# EAGLE design adc (EAGLE 6.6.0)
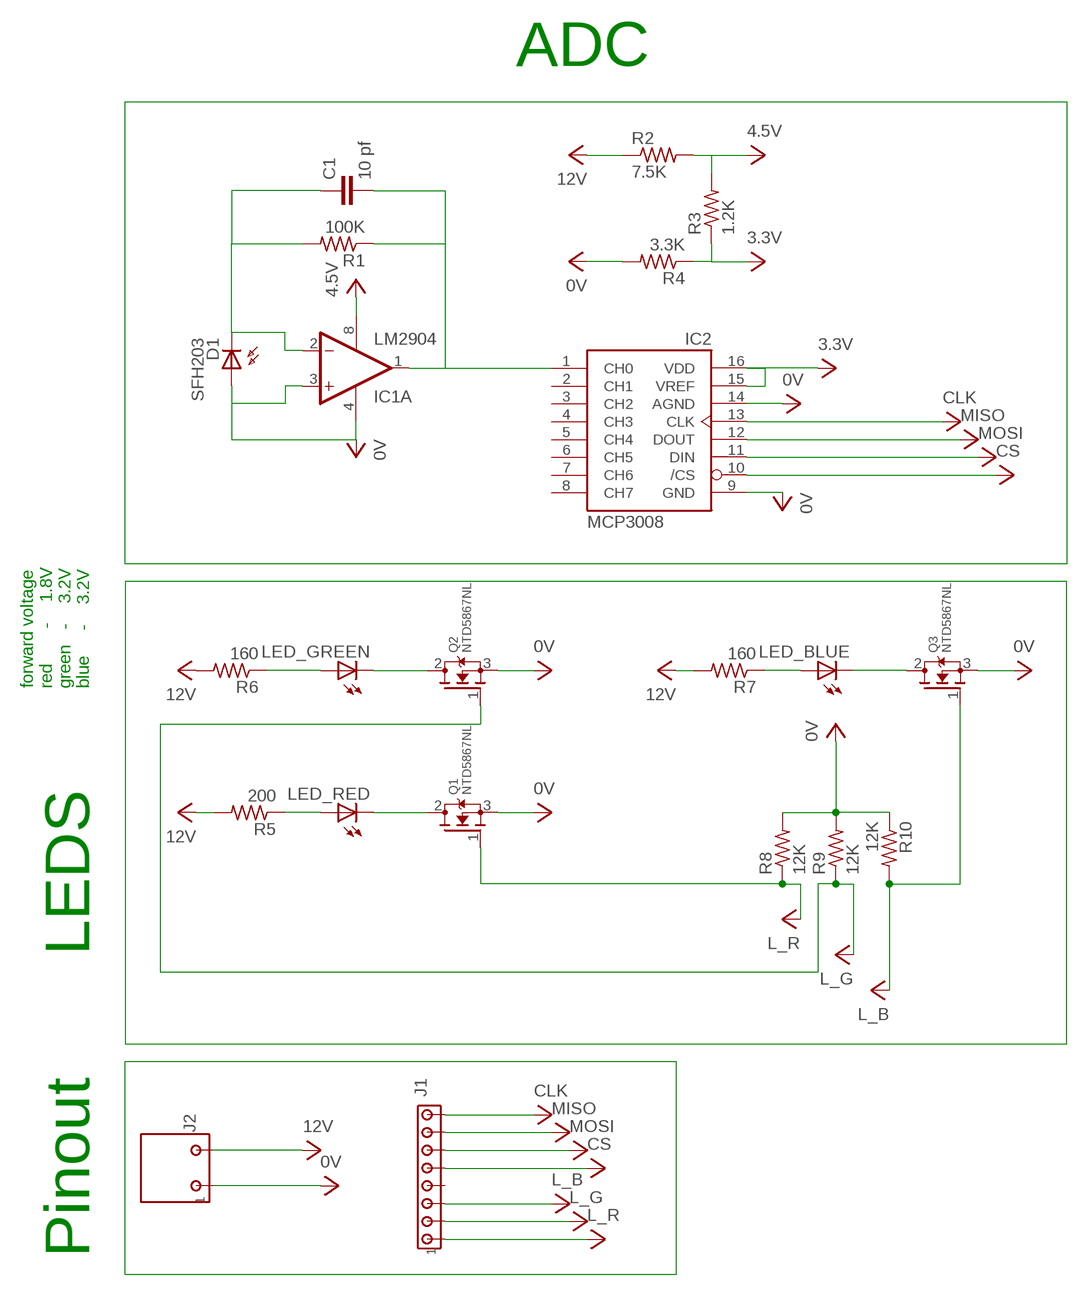
[diagram p0: schematic, sheet 1]

## Parts
C1  10 pf  C5/2.5  [C5B2.5]
D1  SFH203  SFH205  [SFH205]
IC1  LM2904  LM358N  [DIL08]
IC2  MCP3008  [DIL16]
J1  MTA08-100  [10X08MTA]
J2  MTA03-100  [10X03MTA]
LED_BLUE  LED5MM  [LED5MM]
LED_GREEN  LED5MM  [LED5MM]
LED_RED  LED5MM  [LED5MM]
Q1  NTD5867NL  MOSFET-NGDS_TO220V  [TO220V]
Q2  NTD5867NL  MOSFET-NGDS_TO220V  [TO220V]
Q3  NTD5867NL  MOSFET-NGDS_TO220V  [TO220V]
R1  100K  R-US_0207/10  [0207/10]
R2  7.5K  R-US_0207/10  [0207/10]
R3  1.2K  R-US_0207/10  [0207/10]
R4  3.3K  R-US_0207/10  [0207/10]
R5  200  R-US_0207/10  [0207/10]
R6  160  R-US_0207/10  [0207/10]
R7  160  R-US_0207/10  [0207/10]
R8  12K  R-US_0207/10  [0207/10]
R9  12K  R-US_0207/10  [0207/10]
R10  12K  R-US_0207/10  [0207/10]

## Nets
0V: D1.A IC1.3(A:+IN) IC1.4(P:V-) IC2.9(GND) IC2.14(AGND) J2.1 Q1.3(S) Q2.3(S) Q3.3(S) R4.2 R8.2 R9.2 R10.1
3.3V: IC2.15(VREF) IC2.16(VDD) R3.1 R4.1
4.5V: IC1.8(P:V+) R2.2 R3.2
12V: J2.3 R2.1 R5.2 R6.2 R7.2
CLK: IC2.13(CLK) J1.8
CS: IC2.10(/CS) J1.5
L_B: J1.3 Q3.1(G) R10.2
L_G: J1.2 Q2.1(G) R9.1
L_R: J1.1 Q1.1(G) R8.1
MISO: IC2.12(DOUT) J1.7
MOSI: IC2.11(DIN) J1.6
N$1: C1.1 D1.K(C) IC1.2(A:-IN) R1.2
N$2: LED_BLUE.K(C) Q3.2(D)
N$3: LED_RED.A R5.1
N$6: LED_RED.K(C) Q1.2(D)
N$7: C1.2 IC1.1(A:OUT) IC2.1(CH0) R1.1
N$8: LED_BLUE.A R7.1
N$12: LED_GREEN.A R6.1
N$13: LED_GREEN.K(C) Q2.2(D)
Unconnected: IC1.5(B:+IN) IC1.6(B:-IN) IC1.7(B:OUT) IC2.2(CH1) IC2.3(CH2) IC2.4(CH3) IC2.5(CH4) IC2.6(CH5) IC2.7(CH6) IC2.8(CH7) J1.4

## Notes on the sheet
- ADC
- forward voltage
  red       -    1.8V
  green   -    3.2V
  blue     -    3.2V
- LEDS
- Pinout

## Library data of the parts
C1 = capacitor-wima:C: CAPACITOR naming: grid - package width
D1 = opto-trans-siemens:SFH205: PHOTO DIODE; OC_FARNELL: unknown; OC_NEWARK: unknown
IC1 = linear:LM358: OP AMP also LM158; LM258; LM2904 Source: http://cache.national.com/ds/LM/LM158.pdf
IC2 = adafruit:MCP3008
J1 = con-amp:MTA08-100: AMP connector
J2 = my_lbr:MTA03-100: AMP connector
LED_BLUE LED_GREEN LED_RED = adafruit:LED: LED OSRAM: - CHIPLED LG R971, LG N971, LY N971, LG Q971, LY Q971, LO R971, LY R971 LH N974, LH R974 LS Q976, LO Q976, LY Q976 LO Q996 - Hyper CHIPLED LW Q18S LB Q993, LB Q99A, LB R99A - SideLED LS A670, LO A670, LY A670, LG A670, LP A670 LB A673, LV A673, LT A673, LW A673 LH A674 LY A675 LS A676, LA A676, LO A676, LY A676, LW A676 LS A679, LY A679, LG A679 - Hyper Micro SIDELED® LS Y876, LA Y876, LO Y876, LY Y876 LT Y87S - SmartLED LW L88C, LW L88S LB L89C, LB L89S, LG L890 LS L89K, LO L89K, LY L89K LS L896, LA L896, LO L896, LY L896 - TOPLED LS T670, LO T670, LY T670, LG T670, LP T670 LSG T670, LSP T670, LSY T670, LOP T670, LYG T670 LG T671, LOG T671, LSG T671 LB T673, LV T673, LT T673, LW T673 LH T674 LS T676, LA T676, LO T676, LY T676, LB T676, LH T676, LSB T676, LW T676 LB T67C, LV T67C, LT T67C, LS T67K, LO T67K, LY T67K, LW E67C LS E67B, LA E67B, LO E67B, LY E67B, LB E67C, LV E67C, LT E67C LW T67C LS T679, LY T679, LG T679 LS T770, LO T770, LY T770, LG T770, LP T770 LB T773, LV T773, LT T773, LW T773 LH T774 LS E675, LA E675, LY E675, LS T675 LS T776, LA T776, LO T776, LY T776, LB T776 LHGB T686 LT T68C, LB T68C - Hyper Mini TOPLED® LB M676 - Mini TOPLED Santana® LG M470 LS M47K, LO M47K, LY M47K Source: http://www.osram.convergy.de/
Q1-Q3 = adafruit:MOSFET-N: N-Channel Mosfet 2N7002E - 60V 260mA SOT23 [Digikey: 2N7002ET1GOSTR-ND] - REEL BSH103 - 30V 850mA SOT23 [Digikey: 568-5013-1-ND]
R1-R10 = rcl:R-US_: RESISTOR, American symbol

## Board
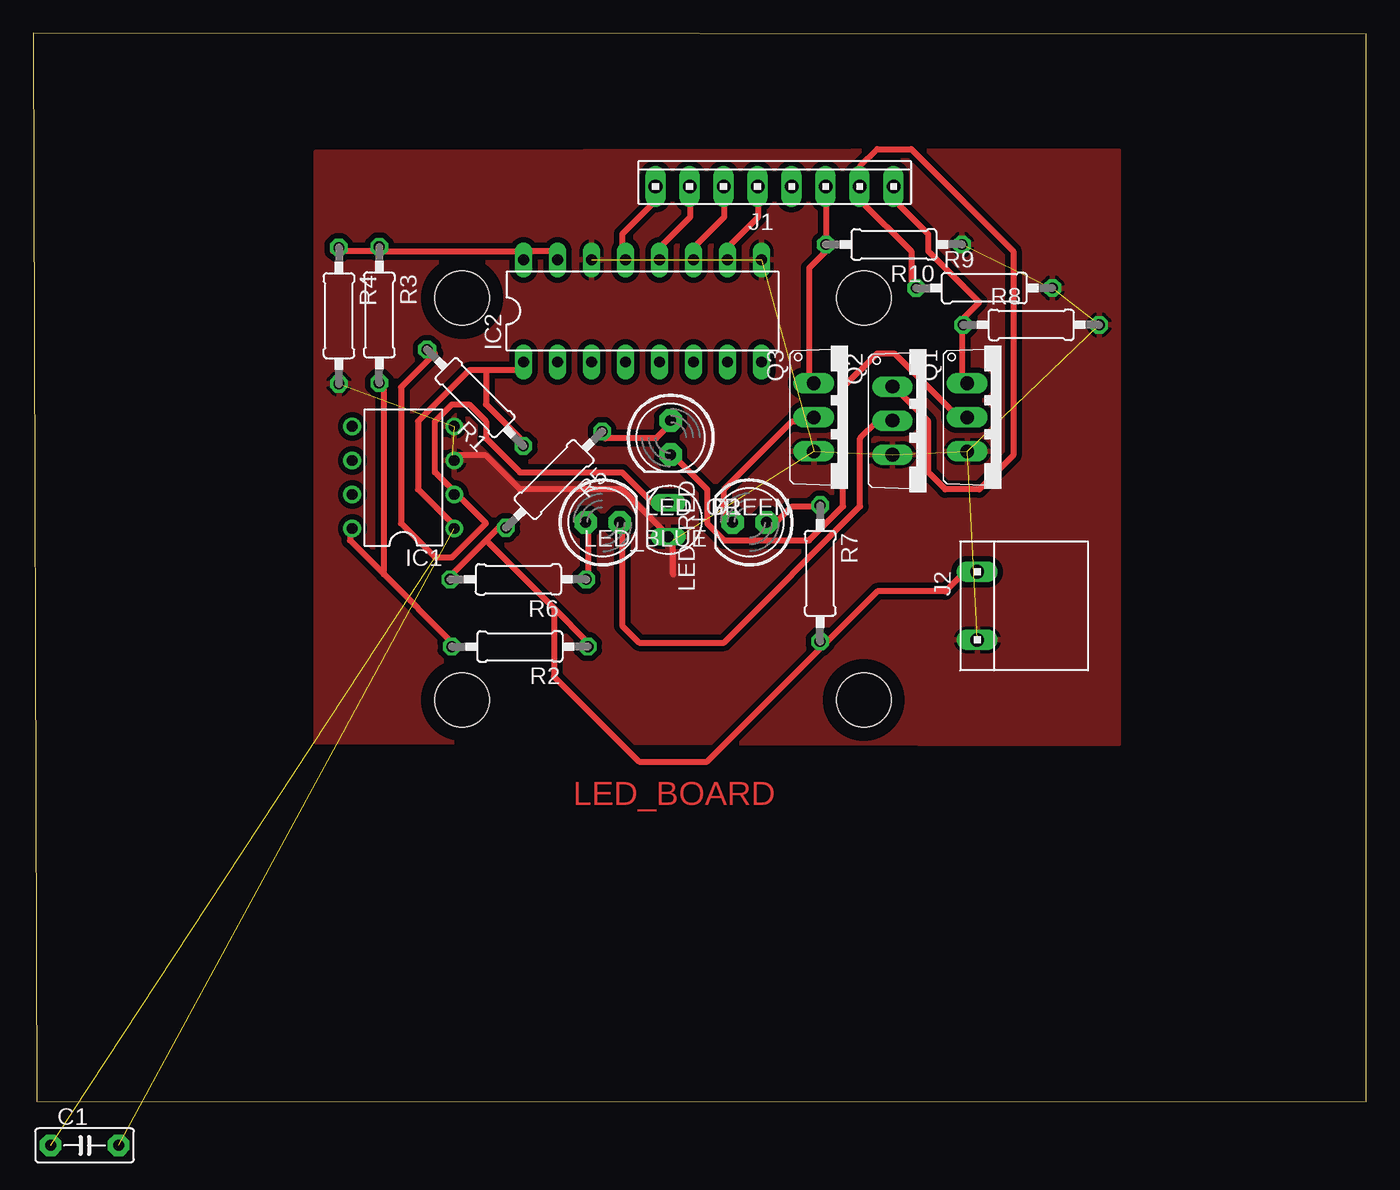
[diagram p1: board, top side]

Size 99.5 x 79.75 mm. Coordinates in mm from the lower left corner, seen from the top.
Outline: 0.25,0.07 99.5,0 99.5,79.68 0,79.75 0.25,0.07
Copper layers (1*16): Top 0.035mm / dielectric 1.5mm / Bottom 0.035mm
Design rules "default *": minimum track width 18mil, minimum drill 24mil, track to track 16mil, track to pad 10mil, pad to pad 10mil, via to via 8mil, smd to smd 8mil, copper to edge 40mil, drill to drill 8mil, minimum pad ring 10mil, minimum via ring 8mil, stop-mask expansion 4mil, vias tented up to drill 0mil, thermal gap 10mil
Holes 4.06 mm at 32,60 32,30 62,30 62,60

### Footprints (pad centres in the part's own frame; a part is rotated, then mirrored left to right if it is on the bottom)
C5B2.5 = drill 0.813 pad 1.6 octagon: 1 -2.54,0; 2 2.54,0
SFH205 = drill 0.813 long: A 0,-1.27; K 0,1.27
DIL08 = drill 0.813 pad 1.27: 1 -3.81,-3.81; 2 -1.27,-3.81; 3 1.27,-3.81; 4 3.81,-3.81; 5 3.81,3.81; 6 1.27,3.81; 7 -1.27,3.81; 8 -3.81,3.81
DIL16 = drill 0.813 long: 1 -8.89,-3.81; 2 -6.35,-3.81; 3 -3.81,-3.81; 4 -1.27,-3.81; 5 1.27,-3.81; 6 3.81,-3.81; 7 6.35,-3.81; 8 8.89,-3.81; 9 8.89,3.81; 10 6.35,3.81; 11 3.81,3.81; 12 1.27,3.81; 13 -1.27,3.81; 14 -3.81,3.81; 15 -6.35,3.81; 16 -8.89,3.81
10X08MTA = drill 1.016 long: 1 8.89,0; 2 6.35,0; 3 3.81,0; 4 1.27,0; 5 -1.27,0; 6 -3.81,0; 7 -6.35,0; 8 -8.89,0
10X03MTA = drill 1.016 long: 1 2.54,0; 3 -2.54,0
LED5MM = drill 0.813 pad 1.676 octagon: A -1.27,0; K 1.27,0
TO220V = drill 1.016 long: 1 -2.54,-2.54; 2 0,-2.54; 3 2.54,-2.54
0207/10 = drill 0.813 octagon: 1 -5.08,0; 2 5.08,0

### Placement (x,y rotation side)
C1  3.82,-3.24 0 top  (outside the outline)
D1  47.39,43.45 0 top
IC1  27.61,46.61 90 top
IC2  45.47,59.04 0 top
J1  55.34,68.33 0 top
J2  70.47,37.03 270 top
LED_BLUE  53.47,43.26 180 top
LED_GREEN  42.5,43.26 0 top
LED_RED  47.58,49.59 270 top
Q1  72.27,51.1 270 top
Q2  66.68,50.85 270 top
Q3  60.8,51.1 270 top
R1  32.98,52.56 135 top
R2  36.31,33.98 180 top
R3  25.82,58.74 270 top
R4  22.8,58.69 270 top
R5  38.87,46.45 225 top
R6  36.2,39 180 top
R7  58.74,39.45 270 top
R8  74.5,58 0 top
R9  71,60.75 0 top
R10  64.25,64 180 top

### Tracks (layer width: path | path; a pad name or v marks a point on that pad's centre or on a via)
0V  (11 unrouted)
  Top 0.457: 47.76,39.37 47.76,41.91 | 47.76,41.91 43.95,45.72 36.33,45.72 33.79,48.26 31.25,48.26 IC1.3 | 47.76,41.91 D1.A
  pour Top: 21.11,70.88 81,71 81,26.75 21.11,26.88
3.3V
  Top 0.457: 36.33,63.5 38.87,63.5 IC2.15 | 26.17,63.5 22.36,63.5 R4.1 | 26.17,63.5 36.33,63.5 | 36.33,63.5 IC2.16 | 26.17,63.5 R3.1
4.5V
  Top 0.457: 26.17,39.37 23.63,41.91 23.63,43.18 IC1.8 | 26.17,39.37 31.25,34.29 R2.2 | 26.17,39.37 26.17,53.34 R3.2
12V
  Top 0.457: 59.19,34.29 63,38.1 68.08,38.1 69.35,39.37 J2.3 | 33.79,41.91 35.06,43.18 R5.2 | 33.79,41.91 31.25,39.37 R6.2 | 33.79,41.91 38.87,36.83 | 38.87,36.83 41.41,34.29 R2.1 | 59.19,34.29 50.3,25.4 45.22,25.4 38.87,31.75 38.87,36.83 | 59.19,34.29 R7.2
CLK
  Top 0.457: IC2.13 43.95,63.5 43.95,64.77 46.49,67.31 J1.8
CS
  Top 0.457: IC2.10 51.57,63.5 54.11,66.04 54.11,67.31 J1.5
L_B
  Top 0.457: 59.19,63.5 59.19,67.31 J1.3 | 59.19,63.5 57.92,62.23 57.92,53.34 Q3.1 | 59.19,63.5 R10.2
L_G
  Top 0.457: R9.1 65.54,60.96 65.54,63.5 61.73,67.31 J1.2 61.73,68.58 61.73,69.85 63,71.12 65.54,71.12 73.16,63.5 73.16,48.26 70.62,45.72 68.08,45.72 66.81,46.99 66.81,50.8 64.27,53.34 Q2.1
L_R
  Top 0.457: 69.35,58.42 69.35,53.34 Q1.1 | 69.35,58.42 70.62,59.69 66.81,63.5 66.81,64.77 64.27,67.31 J1.1 | 69.35,58.42 R8.1
MISO
  Top 0.457: IC2.12 46.49,63.5 49.03,66.04 49.03,67.31 J1.7
MOSI
  Top 0.457: IC2.11 49.03,63.5 51.57,66.04 51.57,67.31 J1.6
N$1  (1 unrouted)
  Top 0.457: 31.25,45.72 33.79,43.18 31.25,40.64 29.98,40.64 27.44,43.18 27.44,53.34 29.98,55.88 R1.2 | 31.25,45.72 29.98,46.99 29.98,50.8 31.25,52.07 32.52,52.07 33.79,50.8 33.79,49.53 36.33,46.99 43.95,46.99 46.49,44.45 D1.K | 31.25,45.72 IC1.2
N$2
  Top 0.457: Q3.2 57.92,50.8 56.65,50.8 51.57,45.72 51.57,43.18 LED_BLUE.K
N$3
  Top 0.457: R5.1 42.68,49.53 46.49,49.53 47.76,50.8 LED_RED.A
N$6
  Top 0.457: Q1.2 69.35,50.8 64.27,55.88 63,55.88 60.46,53.34 60.46,44.45 57.92,41.91 51.57,41.91 50.3,43.18 50.3,45.72 47.76,48.26 LED_RED.K
N$7  (1 unrouted)
  Top 0.457: 33.79,54.61 36.33,54.61 IC2.1 | 33.79,54.61 32.52,54.61 28.71,50.8 28.71,45.72 31.25,43.18 IC1.1 | 33.79,54.61 33.79,52.07 36.33,49.53 R1.1
N$8
  Top 0.457: R7.1 59.19,44.45 56.65,44.45 55.38,43.18 LED_BLUE.A
N$12
  Top 0.457: R6.1 41.41,39.37 41.41,43.18 LED_GREEN.A
N$13
  Top 0.457: Q2.2 63,50.8 61.73,49.53 61.73,44.45 51.57,34.29 45.22,34.29 43.95,35.56 43.95,43.18 LED_GREEN.K

### Text on the board
Top: LED_BOARD